# Altium schematic sheet P-MOS_NPN.SchDoc: P-Mos NPN Driver
size A4; CompanyName: github.com/aKaReZa75; Revision: 1.0; SheetNumber: 1; SheetTotal: 1; Project_Name: Design Template
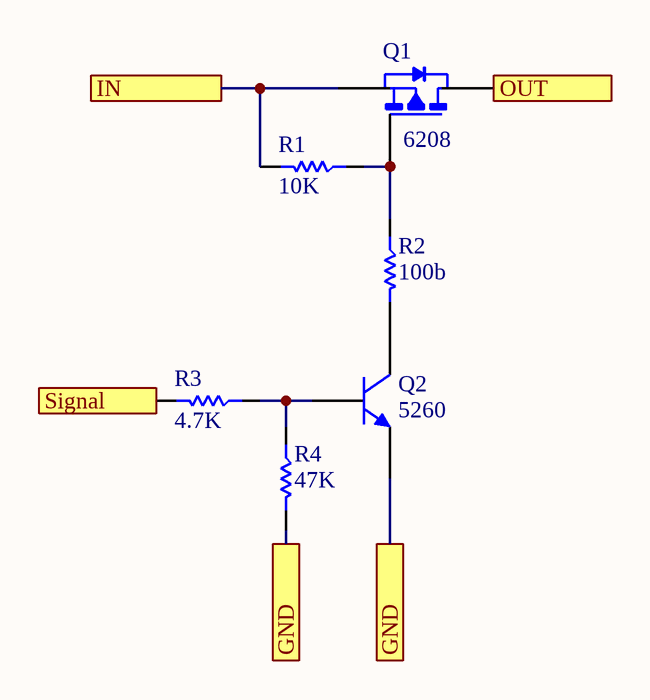
[diagram p0: P-MOS_NPN.SchDoc]

## Parts
Q1  Inflow: 6208  [SOT23_N]  (hidden comment: P-Channel)
Q2  Inflow: 5260  [SOT23_N]  (hidden comment: NPN)
R1  10K  [RES 0805 (2012X06L)]
R2  100b  [RES 0805 (2012X06L)]
R3  4.7K  [RES 0805 (2012X06L)]
R4  47K  [RES 0805 (2012X06L)]

## Ports
GND, IN, OUT, Signal

## Nets
GND: Q2.2(E) R4.2 ; port GND
IN: Q1.2(S) R1.2 ; port IN
OUT: Q1.3(D) ; port OUT
Signal: R3.2 ; port Signal
NetQ1_1: Q1.1(G) R1.1 R2.1
NetQ2_1: Q2.1(B) R3.1 R4.1
NetQ2_3: Q2.3(C) R2.2

## Notes on the sheet
- Title:
- Project:
- Drawn by:
- Revision:
- Hossein Bagheri
- Company:
- Sheet
- of

## Library data of the parts
Q1 = Semi_MOSFET_Si2301DS: P-Channel MOSFET; Rating: Rating?; Type: Type?; Value: P-Channel; Package: Package?
Q2 = Semi_BJT_2N2222_SMD: NPN Switching Transistors; Rating: Rating?; Type: Type?; Value: NPN; Package: Package?
R1-R4 = Res_SMD_0805: Resistor; Inflow: inflow?; Rating: 0.125W; Package: 0805; Type: 10%
  R1: Value: 10K
  R2: Value: 100b
  R3: Value: 4.7K
  R4: Value: 47K